# EAGLE design AM27S13 (EAGLE 6.6.0)
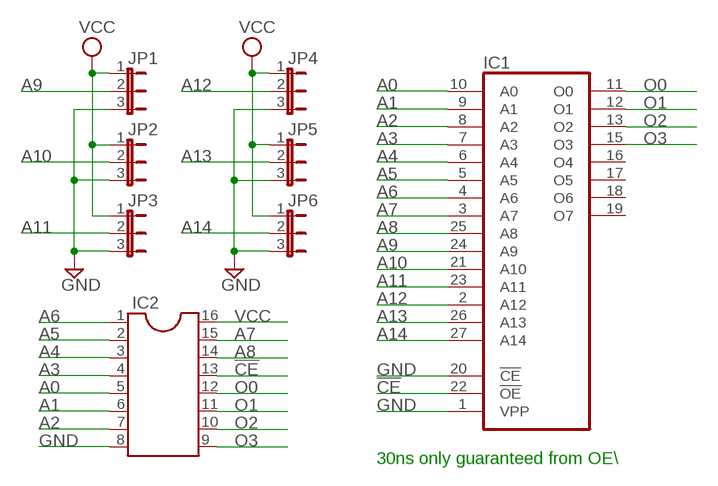
[diagram p0: schematic, sheet 1]

## Parts
IC1  27256  [DIL28]
IC2  DIL16  [DIL16]
JP1  JP2E  [JP2]
JP2  JP2E  [JP2]
JP3  JP2E  [JP2]
JP4  JP2E  [JP2]
JP5  JP2E  [JP2]
JP6  JP2E  [JP2]

## Nets
!CE: IC1.22(!OE) IC2.13
A0: IC1.10(A0) IC2.5
A1: IC1.9(A1) IC2.6
A2: IC1.8(A2) IC2.7
A3: IC1.7(A3) IC2.4
A4: IC1.6(A4) IC2.3
A5: IC1.5(A5) IC2.2
A6: IC1.4(A6) IC2.1
A7: IC1.3(A7) IC2.15
A8: IC1.25(A8) IC2.14
A9: IC1.24(A9) JP1.2
A10: IC1.21(A10) JP2.2
A11: IC1.23(A11) JP3.2
A12: IC1.2(A12) JP4.2
A13: IC1.26(A13) JP5.2
A14: IC1.27(A14) JP6.2
GND: IC1.1(VPP) IC1.20(!CE) IC2.8 JP1.3 JP2.3 JP3.3 JP4.3 JP5.3 JP6.3
O0: IC1.11(O0) IC2.12
O1: IC1.12(O1) IC2.11
O2: IC1.13(O2) IC2.10
O3: IC1.15(O3) IC2.9
VCC: IC2.16 JP1.1 JP2.1 JP3.1 JP4.1 JP5.1 JP6.1
Unconnected: IC1.16(O4) IC1.17(O5) IC1.18(O6) IC1.19(O7)

## Notes on the sheet
- 30ns only guaranteed from OE\\

## Power pins joined to a net without a drawn wire
GND: IC1.14(GND)
VCC: IC1.28(VCC)

## Library data of the parts
IC1 = memory:27256: MEMORY
IC2 = ic-package:DIL16: Dual In Line / Socket
JP1-JP6 = jumper:JP2E: JUMPER

## Board
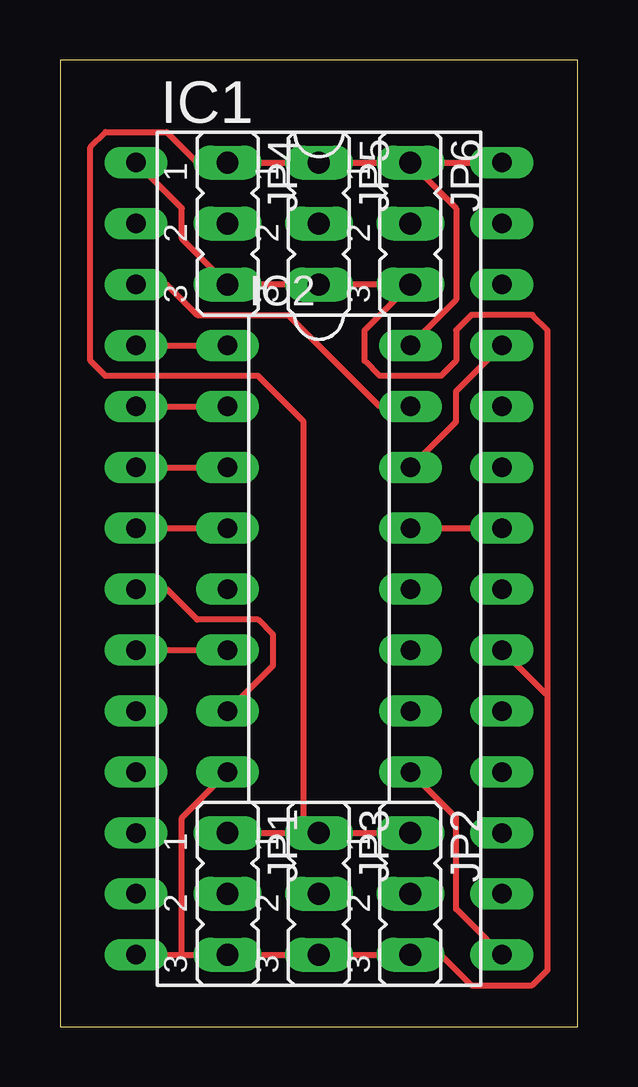
[diagram p1: board, top side]
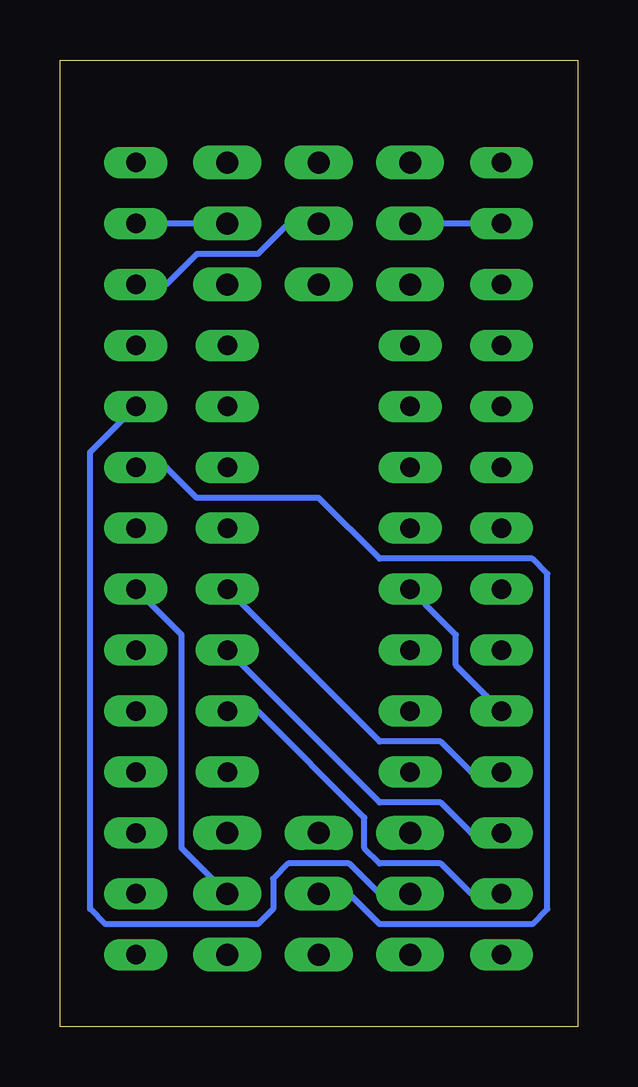
[diagram p2: board, bottom side, seen from below]

Size 21.57 x 40.31 mm. Coordinates in mm from the lower left corner, seen from the top.
Outline: 0,0 21.57,0 21.57,40.31 0,40.31 0,0
Copper layers (1*16): Top 0.035mm / dielectric 1.5mm / Bottom 0.035mm
Design rules "olimex8mil": minimum track width 10mil, minimum drill 24mil, track to track 8mil, track to pad 8mil, pad to pad 8mil, via to via 8mil, smd to smd 8mil, copper to edge 40mil, drill to drill 10mil, minimum pad ring 10mil, minimum via ring 8mil, stop-mask expansion 0mil, vias tented up to drill 0mil, thermal gap 10mil

### Footprints (pad centres in the part's own frame; a part is rotated, then mirrored left to right if it is on the bottom)
DIL28 = drill 0.813 long: 1 -16.51,-7.62; 2 -13.97,-7.62; 3 -11.43,-7.62; 4 -8.89,-7.62; 5 -6.35,-7.62; 6 -3.81,-7.62; 7 -1.27,-7.62; 8 1.27,-7.62; 9 3.81,-7.62; 10 6.35,-7.62; 11 8.89,-7.62; 12 11.43,-7.62; 13 13.97,-7.62; 14 16.51,-7.62; 15 16.51,7.62; 16 13.97,7.62; 17 11.43,7.62; 18 8.89,7.62; 19 6.35,7.62; 20 3.81,7.62; 21 1.27,7.62; 22 -1.27,7.62; 23 -3.81,7.62; 24 -6.35,7.62; 25 -8.89,7.62; 26 -11.43,7.62; 27 -13.97,7.62; 28 -16.51,7.62
DIL16 = drill 0.813 long: 1 -8.89,-3.81; 2 -6.35,-3.81; 3 -3.81,-3.81; 4 -1.27,-3.81; 5 1.27,-3.81; 6 3.81,-3.81; 7 6.35,-3.81; 8 8.89,-3.81; 9 8.89,3.81; 10 6.35,3.81; 11 3.81,3.81; 12 1.27,3.81; 13 -1.27,3.81; 14 -3.81,3.81; 15 -6.35,3.81; 16 -8.89,3.81
JP2 = drill 0.914 long: 1 -2.54,0; 2 0,0; 3 2.54,0

### Placement (x,y rotation side)
IC1  10.79,19.52 270 top
IC2  10.79,19.52 270 top
JP1  6.98,5.55 270 top
JP2  14.6,5.55 270 top
JP3  10.79,5.55 270 top
JP4  6.98,33.49 270 top
JP5  10.79,33.49 270 top
JP6  14.6,33.49 270 top

### Tracks (layer width: path | path; a pad name or v marks a point on that pad's centre or on a via)
!CE
  Top 0.254: IC2.13 15.87,20.79 17.14,20.79 IC1.22
A0
  Bottom 0.254: IC1.10 3.8,13.81 5.08,15.08 5.08,16.34 6.34,17.61 IC2.5
A1
  Top 0.254: IC1.9 4.44,15.71 5.71,15.71 IC2.6
A2
  Top 0.254: IC2.7 7.62,13.81 8.89,15.08 8.89,16.34 8.25,16.98 5.71,16.98 4.44,18.25 IC1.8
A3
  Top 0.254: IC1.7 4.44,20.79 5.71,20.79 IC2.4
A4
  Top 0.254: IC1.6 4.44,23.33 5.71,23.33 IC2.3
A5
  Top 0.254: IC1.5 4.44,25.87 5.71,25.87 IC2.2
A6
  Top 0.254: IC1.4 4.44,28.41 5.71,28.41 IC2.1
A7
  Top 0.254: IC1.3 4.44,30.95 5.71,29.68 9.52,29.68 13.33,25.87 IC2.15
A8
  Top 0.254: IC2.14 15.24,23.96 16.5,25.23 16.5,26.5 17.77,27.77 IC1.25
A9
  Bottom 0.254: IC1.24 19.04,25.23 20.31,23.96 20.31,4.92 19.68,4.28 13.33,4.28 12.7,4.92 12.7,6.18 12.06,6.82 9.52,6.82 8.25,5.55 JP1.2
A10
  Bottom 0.254: IC1.21 17.77,17.61 16.5,16.34 16.5,7.46 15.24,6.18 JP2.2
A11
  Bottom 0.254: IC1.23 17.14,23.33 15.87,22.06 10.79,22.06 8.25,19.52 1.9,19.52 1.27,18.88 1.27,4.92 1.9,4.28 8.25,4.28 9.52,5.55 JP3.2
A12
  Bottom 0.254: IC1.2 4.44,33.49 5.71,33.49 JP4.2
A13
  Bottom 0.254: IC1.26 17.14,30.95 15.87,32.22 13.33,32.22 12.06,33.49 JP5.2
A14
  Bottom 0.254: IC1.27 17.14,33.49 15.87,33.49 JP6.2
GND
  Top 0.254: IC1.1 3.8,35.39 5.08,34.12 5.08,32.85 6.34,31.58 JP4.3 8.25,30.95 9.52,30.95 JP5.3 12.06,30.95 13.33,30.95 JP6.3 13.97,30.31 12.7,29.04 12.7,27.77 13.33,27.14 15.87,27.14 16.5,27.77 16.5,29.04 17.14,29.68 19.68,29.68 20.31,29.04 20.31,13.81 | 5.08,3.01 5.71,3.01 JP1.3 8.25,3.01 9.52,3.01 JP3.3 12.06,3.01 13.33,3.01 JP2.3 15.87,3.01 17.14,1.74 19.68,1.74 20.31,2.38 20.31,13.81 | 5.08,3.01 4.44,3.01 IC1.14 | 5.08,3.01 5.08,8.73 6.34,10 IC2.8 | 20.31,13.81 19.04,15.08 IC1.20
O0
  Bottom 0.254: IC1.11 4.44,10.63 5.71,11.9 8.25,11.9 13.97,17.61 IC2.12
O1
  Bottom 0.254: IC1.12 4.44,8.09 5.71,9.36 8.25,9.36 13.97,15.08 IC2.11
O2
  Bottom 0.254: IC1.13 4.44,5.55 5.71,6.82 8.25,6.82 8.89,7.46 8.89,8.73 13.33,13.17 IC2.10
O3
  Top 0.254: IC1.15 17.77,3.64 16.5,4.92 16.5,8.73 15.24,10 IC2.9
VCC
  Top 0.254: JP1.1 8.25,8.09 9.52,8.09 JP3.1 | JP2.1 13.33,8.09 12.06,8.09 JP3.1 | IC2.16 15.24,29.04 16.5,30.31 16.5,34.12 15.24,35.39 JP6.1 | IC1.28 17.14,36.03 15.87,36.03 JP6.1 | JP6.1 13.33,36.03 12.06,36.03 JP5.1 9.52,36.03 8.25,36.03 JP4.1 5.71,36.03 4.44,37.3 1.9,37.3 1.27,36.66 1.27,27.77 1.9,27.14 8.25,27.14 10.16,25.23 10.16,8.73 JP3.1